# EAGLE schematic ov6_conn_teensy (EAGLE 9.6.2)
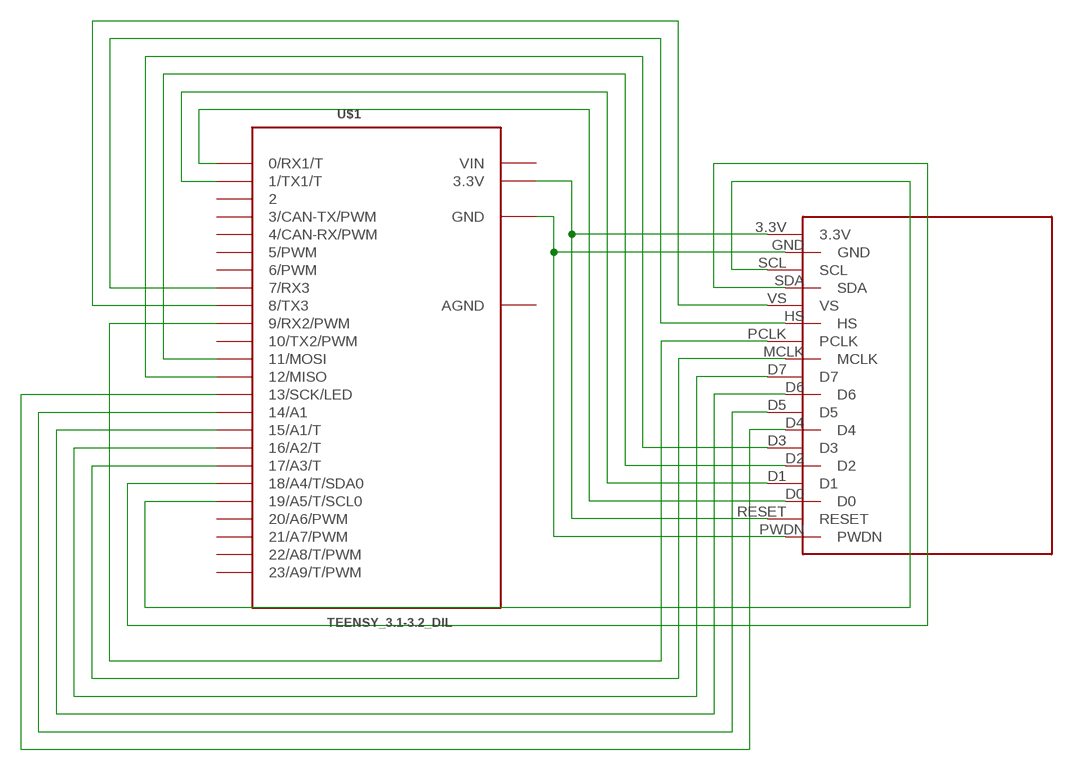
[diagram p0: schematic, sheet 1]

## Parts
U$1  TEENSY_3.1-3.2_DIL  [TEENSY_3.0-3.2&LC_DIL]
U$2  0V7670_CAMERA  [OV7670]

## Nets
N$1: U$1.3.3V U$2.3.3V U$2.RESET
N$2: U$1.GND U$2.GND U$2.PWDN
N$3: U$1.0(0/RX1/T) U$2.D0
N$4: U$1.1(1/TX1/T) U$2.D1
N$5: U$1.11(11/MOSI) U$2.D2
N$6: U$1.12(12/MISO) U$2.D3
N$7: U$1.13(13/SCK/LED) U$2.D4
N$8: U$1.14/A0(14/A1) U$2.D5
N$9: U$1.15/A1(15/A1/T) U$2.D6
N$10: U$1.16/A2(16/A2/T) U$2.D7
N$11: U$1.17/A3(17/A3/T) U$2.MCLK
N$12: U$1.9(9/RX2/PWM) U$2.PCLK
N$13: U$1.7(7/RX3) U$2.HS
N$14: U$1.8(8/TX3) U$2.VS
N$15: U$1.18/A4(18/A4/T/SDA0) U$2.SDA
N$16: U$1.19/A5(19/A5/T/SCL0) U$2.SCL
Unconnected: U$1.2 U$1.3(3/CAN-TX/PWM) U$1.4(4/CAN-RX/PWM) U$1.5(5/PWM) U$1.6(6/PWM) U$1.10(10/TX2/PWM) U$1.20/A6(20/A6/PWM) U$1.21/A7(21/A7/PWM) U$1.22/A8(22/A8/T/PWM) U$1.23/A9(23/A9/T/PWM)

## Power pins joined to a net without a drawn wire
AGND: U$1.AGND
VIN: U$1.VIN

## Library data of the parts
U$1 = Teensy_3_and_LC_Series_Boards_v1.4:TEENSY_3.1-3.2_DIL: Teensy 3.1 or 3.2 in a DIL Layout.
U$2 = OV7670_Camera:0V7670_CAMERA